# Altium schematic sheet 02_ RF Match, Antenna & Power.SchDoc
size 420 x 297 mm; SheetNumber: 2; SheetTotal: 4
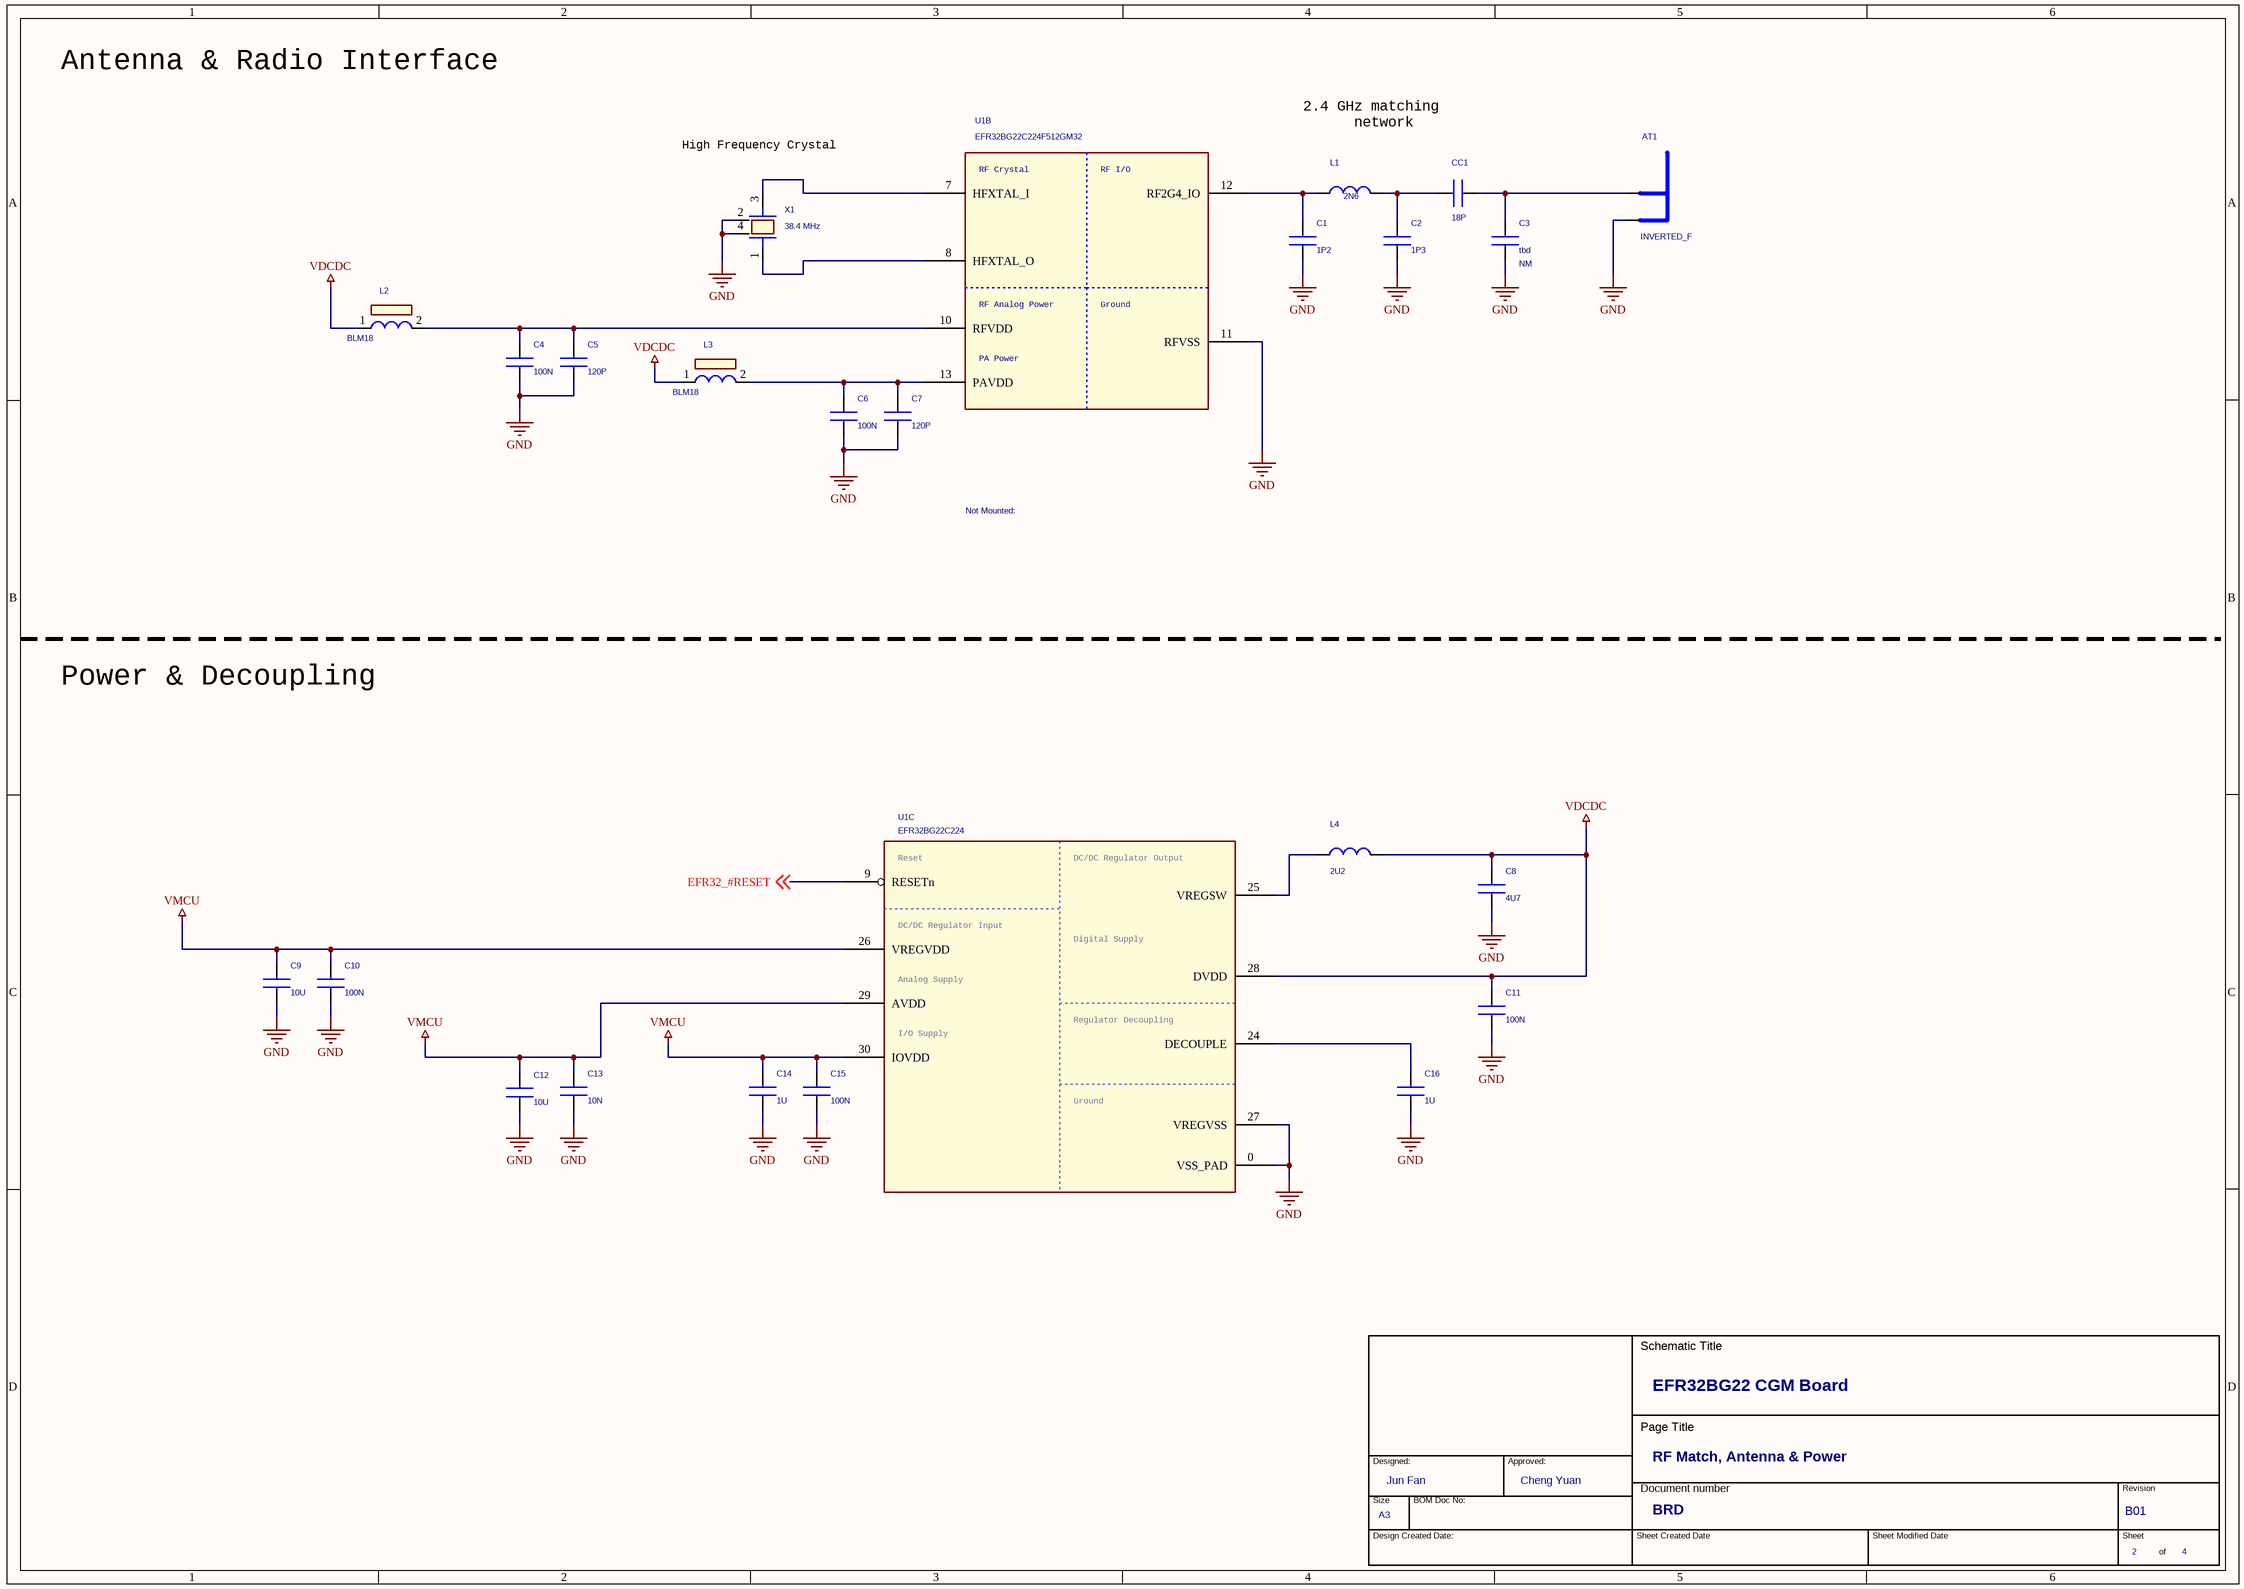
[diagram p0: 02_ RF Match, Antenna & Power.SchDoc]

## Parts
*?  OrgAddr2: Cheng Yuan  OrgAddr1: Jun Fan  Page Count: 4  Page Number: 2  Doc: BRD  Title: EFR32BG22 CGM Board  RevCode: B01  Page Size: A3  Page Title: RF Match, Antenna & Power  (hidden comment: TitleBlock_SiLabs_A3)  (graphical)
AT1  INVERTED_F  [EM358x_INVERTED_F]  (net tie, no BOM)
C1  1P2  [C0201_L]
C2  1P3  [C0201_L]
C3  tbd  Not Mounted: NM  [C0201_L]
C4  100N  [C0201_L]
C5  120P  [C0201_L]
C6  100N  [C0201_L]
C7  120P  [C0201_L]
C8  4U7  [C0603_L]
C9  10U  [C0603_L]
C10  100N  [C0201_L]
C11  100N  [C0201_L]
C12  10U  [C0603_L]
C13  10N  [C0201_L]
C14  1U  [C0402_L]
C15  100N  [C0201_L]
C16  1U  [C0402_L]
CC1  18P  [C0201_L]
L1  2N6  [COIL_0201_L]
L2  BLM18  [COIL_MUR_BLM18_0603]
L3  BLM18  [COIL_MUR_BLM18_0603]
L4  2U2  [COIL_1008_L]
U1  EFR32BG22C224F512GM32  [QFN32_M040_4.0X4.0_EP_SL]  (parts B,C of 3)
X1  38.4 MHz  [KDS_DSX211SH_2016]

## Nets
GND: AT1.2(GND) C1.2 C2.2 C3.2 C4.2 C5.2 C6.2 C7.2 C8.2 C9.2 C10.2 C11.2 C12.2 C13.2 C14.2 C15.2 C16.2 U1.0(VSS_PAD) U1.11(RFVSS) U1.27(VREGVSS) X1.2 X1.4
VDCDC: C8.1 C11.1 L2.1 L3.1 L4.2 U1.28(DVDD)
VMCU: C9.1 C10.1 C12.1 C13.1 C14.1 C15.1 U1.26(VREGVDD) U1.29(AVDD) U1.30(IOVDD)
EFR32_#RESET: U1.9(RESETn) ; off-sheet EFR32_#RESET
NetAT1_1: AT1.1(ANT) C3.1 CC1.2
NetC1_1: C1.1 L1.1 U1.12(RF2G4_IO)
NetC2_1: C2.1 CC1.1 L1.2
NetC4_1: C4.1 C5.1 L2.2 U1.10(RFVDD)
NetC6_1: C6.1 C7.1 L3.2 U1.13(PAVDD)
NetC16_1: C16.1 U1.24(DECOUPLE)
NetL4_1: L4.1 U1.25(VREGSW)
NetU1_7: U1.7(HFXTAL_I) X1.3
NetU1_8: U1.8(HFXTAL_O) X1.1

## Notes on the sheet
- Antenna & Radio Interface
- High Frequency Crystal
- 2.4 GHz matching
  network
- Power & Decoupling
- (in symbol EFR32xG22_QFN32_2G4, part B) RF Crystal; RF I/O; RF Analog Power; Ground; PA Power
- (in symbol EFR32xG22_QFN32_2G4, part C) Reset; DC/DC Regulator Output; DC/DC Regulator Input; Digital Supply; Analog Supply; Regulator Decoupling; I/O Supply; Ground
- (in symbol TitleBlock_SiLabs_A3) Schematic Title; Page Title; Designed:; Approved:; Document number; Revision; Size; BOM Doc No:; Design Created Date:; Sheet Created Date; Sheet Modified Date; Sheet; of

## Library data of the parts
*? = TitleBlock_SiLabs_A3: Cage Code: <Cage Code>
C1 = C0201: Tolerance: ±0.05P; Mfg: Murata; Mfg #: GRM0335C1H1R2WA01D; Technology: C0G
C2 = C0201: Tolerance: ±0.1P; Mfg: Murata; Mfg #: GRM0335C1H1R3BA01D; Technology: C0G
C3 = C0201: Tolerance: ±0.1P; Mfg: Murata; Technology: C0G
C4 C6 C10 C11 C15 = C0201: Rating: 25V; Tolerance: 10%; Technology: X5R
C5 C7 = C0201: Rating: 50V; Tolerance: 5%; Technology: C0G
C8 = C0603: Rating: 6.3V; Tolerance: 20%; Technology: X5R
C9 C12 = C0603: Rating: 25V; Tolerance: 20%; Technology: X5R
C13 = C0201: Rating: 10V; Tolerance: 10%; Technology: X5R
C14 C16 = C0402: Rating: 25V; Tolerance: 10%; Technology: X5R
CC1 = C0201: Tolerance: ±2%; Mfg: Murata; Mfg #: GJM0335C1E180GB01D; Technology: C0G
L1 = L0201: Tolerance: ±0.1N; Mfg #: LQP03HQ2N6B02; Mfg: Murata
L2 L3 = BLM21B102S: Mfg #: BLM18AG102SN1; Mfg: Murata; Price_1K: 0.044
L4 = L1008: Mfg: Samsung; Mfg #: CIG22H2R2MNE; Tolerance: +/-20%
U1 = EFR32xG22_QFN32_2G4: MFG: Silicon Labs; MFG #: EFR32BG22C224F512IM32
X1 = DSX211SH: Mfg: Tai-Saw Technology; Mfg #: TZ3398B; Price_1K: 0.512